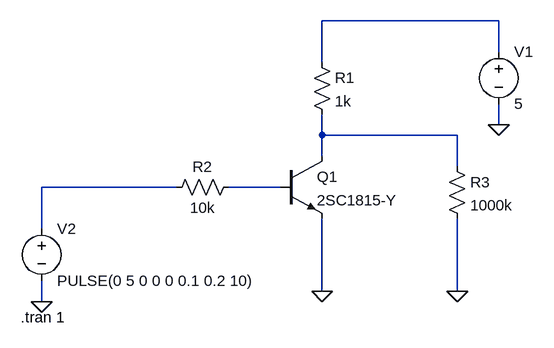
[diagram p0: schematic transistorNOT.asc]
transistorNOT.asc, the LTspice schematic file:
Version 4
SHEET 1 880 744
WIRE 752 272 480 272
WIRE 752 320 752 272
WIRE 480 336 480 272
WIRE 752 432 752 400
WIRE 480 448 480 416
WIRE 688 448 480 448
WIRE 480 480 480 448
WIRE 688 496 688 448
WIRE 256 528 48 528
WIRE 416 528 336 528
WIRE 48 592 48 528
WIRE 480 688 480 576
WIRE 688 688 688 576
WIRE 48 704 48 672
FLAG 480 688 0
FLAG 752 432 0
FLAG 48 704 0
FLAG 688 688 0
SYMBOL npn 416 480 R0
SYMATTR InstName Q1
SYMATTR Value 2SC1815-Y
SYMBOL res 464 320 R0
SYMATTR InstName R1
SYMATTR Value 1k
SYMBOL res 240 544 R270
WINDOW 0 32 56 VTop 2
WINDOW 3 0 56 VBottom 2
SYMATTR InstName R2
SYMATTR Value 10k
SYMBOL voltage 752 304 R0
WINDOW 123 0 0 Left 2
WINDOW 39 0 0 Left 2
SYMATTR InstName V1
SYMATTR Value 5
SYMBOL voltage 48 576 R0
WINDOW 123 0 0 Left 2
WINDOW 39 0 0 Left 2
SYMATTR InstName V2
SYMATTR Value PULSE(0 5 0 0 0 0.1 0.2 10)
SYMBOL res 672 480 R0
SYMATTR InstName R3
SYMATTR Value 1000k
TEXT 16 728 Left 2 !.tran 1

The netlist it stands for:
* transistorNOT.asc
Q1 N002 N004 0 0 2SC1815-Y
R1 N001 N002 1k
R2 N003 N004 10k
V1 N001 0 5
V2 N003 0 PULSE(0 5 0 0 0 0.1 0.2 10)
R3 N002 0 1000k
.model NPN NPN
.model PNP PNP
.lib standard.bjt
.tran 1
.backanno
.end